# EAGLE design Joy2PS2_rev2_1 (EAGLE 7.6.0)
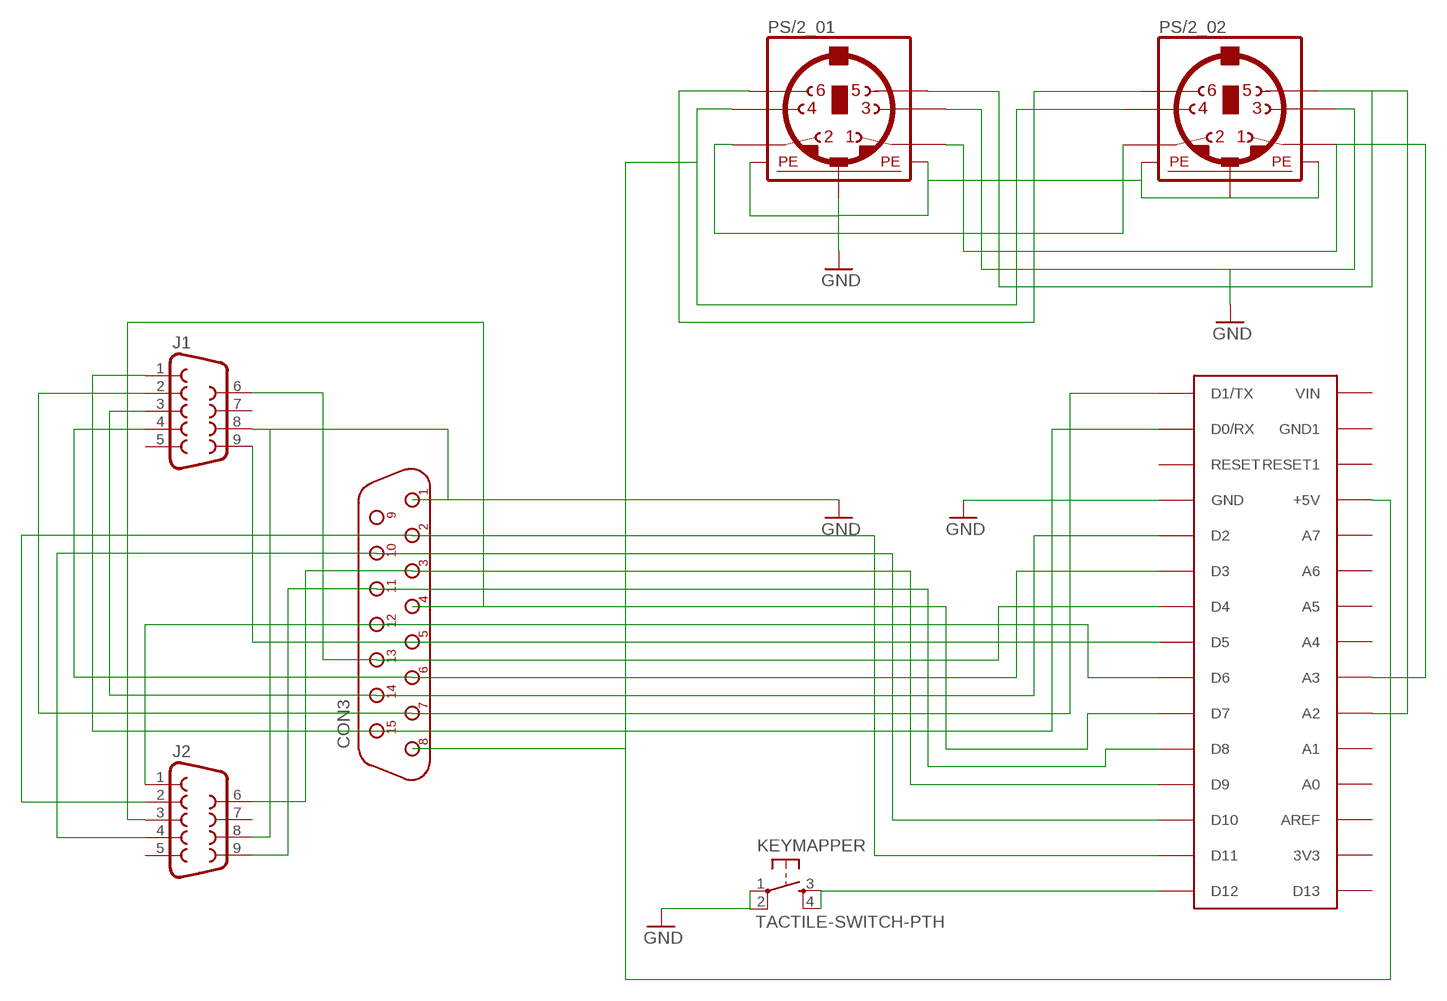
[diagram p0: schematic, sheet 1]

## Parts
ARDUINONANO  ARDUINONANO  [PDIP-32]
CON3  DB15M/90  [D-15M/90]
J1  DB9MALE  [DB9_MALE]
J2  DB9MALE  [DB9_MALE]
KEYMAPPER  TACTILE-SWITCH-PTH  [TAC-SWITCH-PTH]
PS/2_01  MINI_DIN_6  [M_DIN6]
PS/2_02  MINI_DIN_6  [M_DIN6]

## Nets
GND: ARDUINONANO.GND CON3.1 J1.8 J2.8 KEYMAPPER.1 KEYMAPPER.2 PS/2_01.3 PS/2_01.SH1(PE1) PS/2_01.SH2(PE2) PS/2_01.SH3(PE3) PS/2_02.3 PS/2_02.SH1(PE1) PS/2_02.SH2(PE2) PS/2_02.SH3(PE3)
N$1: ARDUINONANO.A3 PS/2_01.1 PS/2_02.1
N$2: PS/2_01.2 PS/2_02.2
N$3: ARDUINONANO.+5V CON3.8 PS/2_01.4 PS/2_02.4
N$5: ARDUINONANO.A2 PS/2_01.5 PS/2_02.5
N$6: ARDUINONANO.D10 CON3.10 J2.4
N$7: ARDUINONANO.D8 CON3.11 J2.9
N$8: ARDUINONANO.D0/RX CON3.15 J1.1
N$9: ARDUINONANO.D1/TX CON3.7 J1.2
N$10: ARDUINONANO.D2 CON3.14 J1.3
N$11: ARDUINONANO.D3 CON3.6 J1.4
N$12: ARDUINONANO.D4 CON3.13 J1.6
N$13: ARDUINONANO.D5 CON3.5 J1.9
N$14: ARDUINONANO.D6 CON3.12 J2.1
N$15: ARDUINONANO.D7 CON3.4 J2.3
N$16: ARDUINONANO.D9 CON3.3 J2.6
N$17: ARDUINONANO.D11 CON3.2 J2.2
N$19: ARDUINONANO.D12 KEYMAPPER.3 KEYMAPPER.4
N$20: PS/2_01.6 PS/2_02.6
Unconnected: ARDUINONANO.3V3 ARDUINONANO.A0 ARDUINONANO.A1 ARDUINONANO.A4 ARDUINONANO.A5 ARDUINONANO.A6 ARDUINONANO.A7 ARDUINONANO.AREF ARDUINONANO.D13 ARDUINONANO.GND1 ARDUINONANO.RESET ARDUINONANO.RESET1 ARDUINONANO.VIN CON3.9 J1.5 J1.7 J2.5 J2.7

## Library data of the parts
ARDUINONANO = jet-lib2:ARDUINONANO
CON3 = connect:DB15M/90
J1 J2 = SparkFun-Connectors:DB9: DB9 Connector Standard DB9 (D-Sub 9) serial connector. Can be used for CAN bus as well as RS485 and RS232. Footprint production proven. Spark Fun Electronics SKU : PRT-00429; PROD_ID: CONN-09904
KEYMAPPER = GeekAmmo:TACTILE-SWITCH: Tactile Switch 4 Pins, SPST NO
PS/2_01 PS/2_02 = mini_din:MINI_DIN_6

## Board
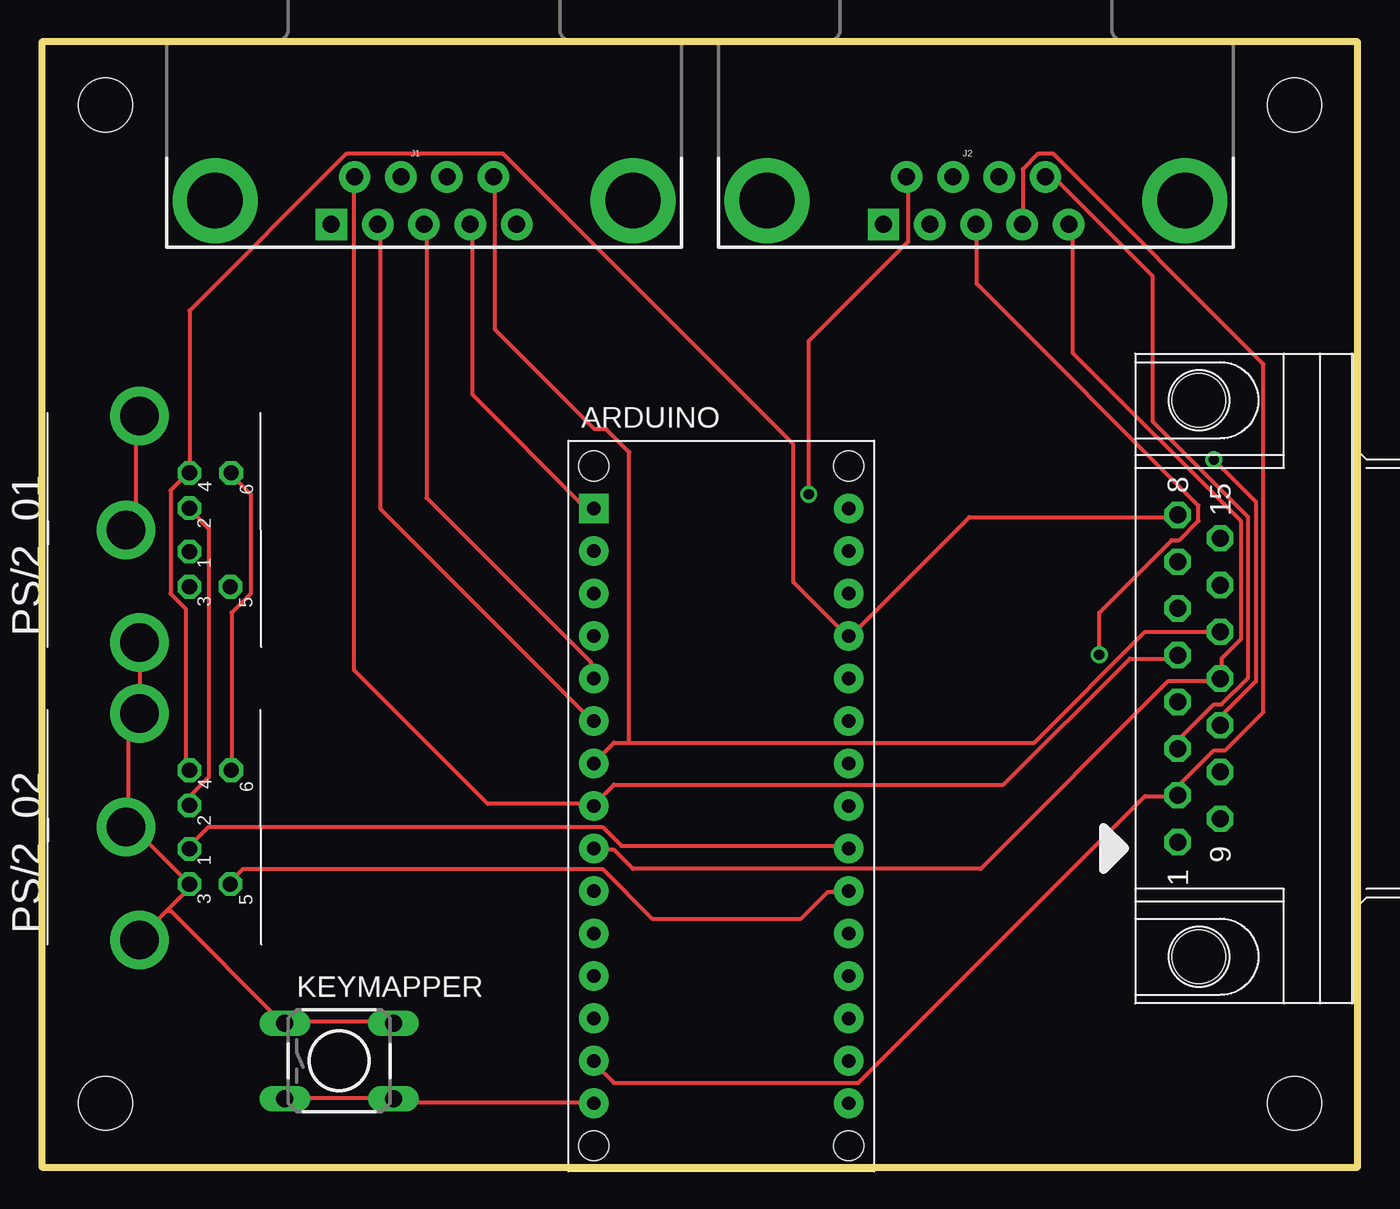
[diagram p1: board, top side]
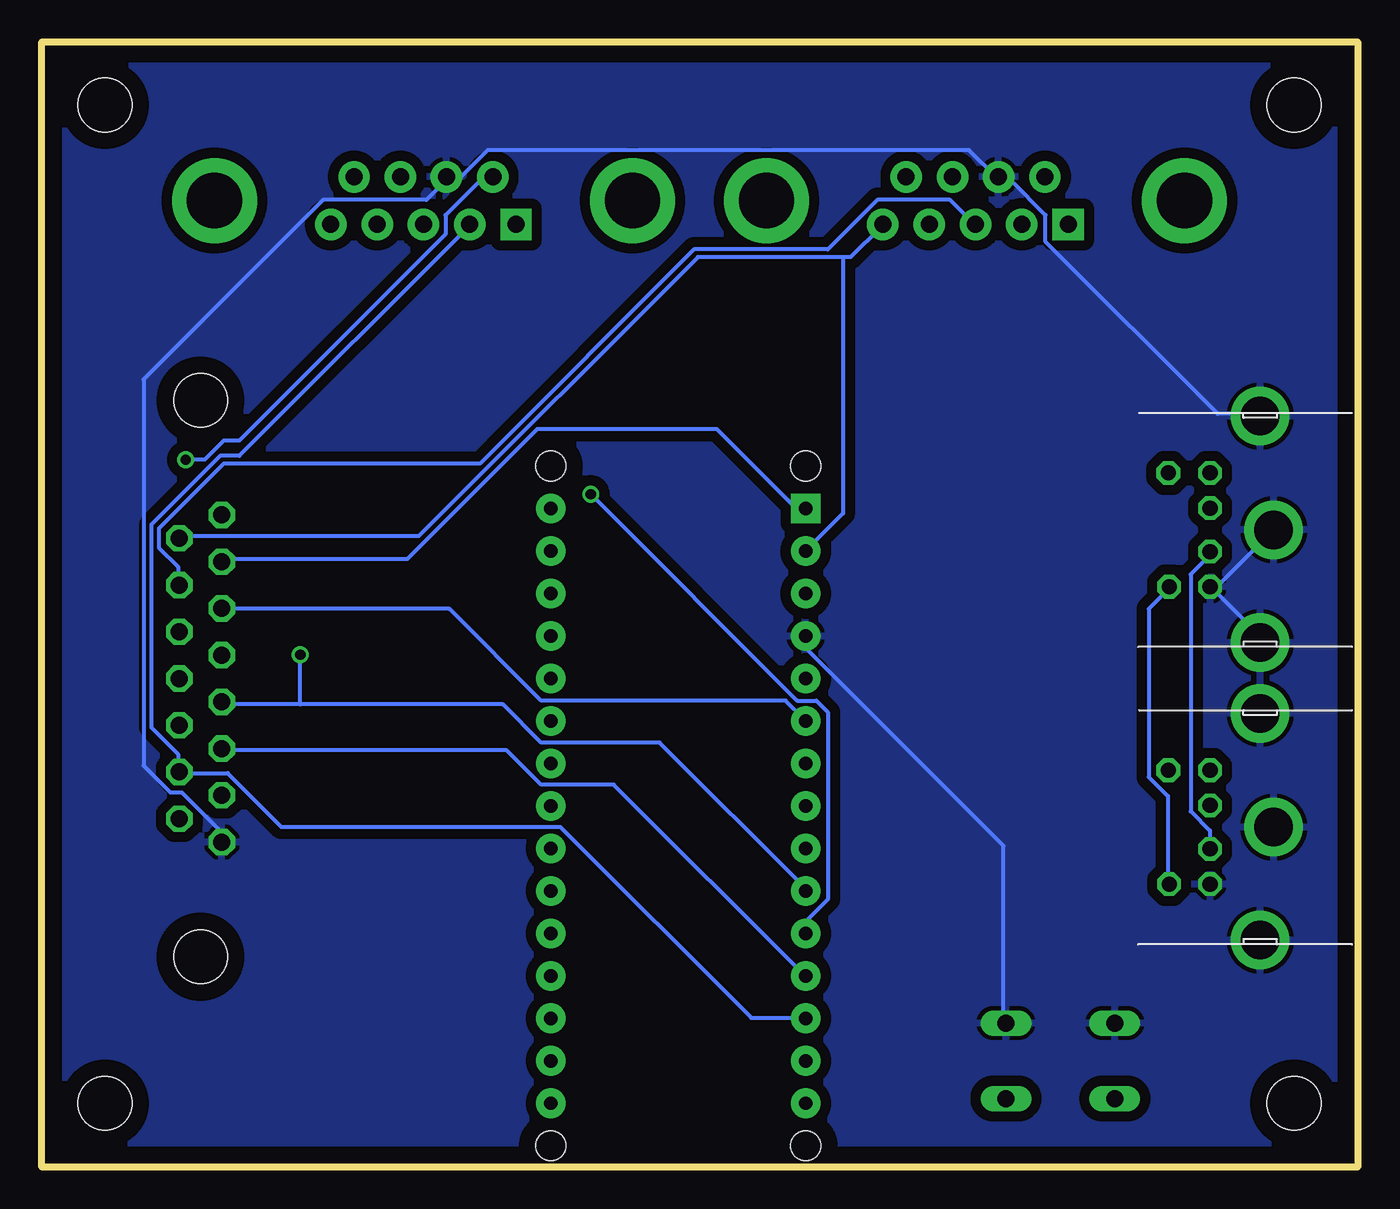
[diagram p2: board, bottom side, seen from below]

Size 78.71 x 67.28 mm. Coordinates in mm from the lower left corner, seen from the top.
Outline: 0,0 78.71,0 78.71,67.28 0,67.28 0,0
Copper layers (1*16): Top 0.035mm / dielectric 1.5mm / Bottom 0.035mm
Design rules "default": minimum track width 10mil, minimum drill 24mil, track to track 8mil, track to pad 8mil, pad to pad 8mil, via to via 8mil, smd to smd 8mil, copper to edge 40mil, drill to drill 8mil, minimum pad ring 10mil, minimum via ring 8mil, stop-mask expansion 4mil, vias tented up to drill 0mil, thermal gap 10mil
Holes 3.2 mm at 74.93,63.5 74.93,3.81 3.81,63.5 3.81,3.81

### Footprints (pad centres in the part's own frame; a part is rotated, then mirrored left to right if it is on the bottom)
PDIP-32 = drill 0.8 pad 1.778: 3V3 15.24,-35.56; +5V 15.24,-10.16; A0 15.24,-30.48; A1 15.24,-27.94; A2 15.24,-25.4; A3 15.24,-22.86; A4 15.24,-20.32; A5 15.24,-17.78; A6 15.24,-15.24; A7 15.24,-12.7; AREF 15.24,-33.02; D0/RX 0,-5.08; D2 0,-12.7; D3 0,-15.24; D4 0,-17.78; D5 0,-20.32; D6 0,-22.86; D7 0,-25.4; D8 0,-27.94; D9 0,-30.48; D10 0,-33.02; D11 0,-35.56; D12 0,-38.1; D13 15.24,-38.1; GND 0,-10.16; GND1 15.24,-5.08; RESET 0,-7.62; RESET1 15.24,-7.62; VIN 15.24,-2.54 | drill 0.8 pad 1.778 square: D1/TX 0,-2.54 | hole 1.778: 0,0; 0,-40.64; 15.24,-40.64; 15.24,0
D-15M/90 = drill 1.016 pad 1.575 octagon: 1 9.779,-1.27; 2 6.985,-1.27; 3 4.191,-1.27; 4 1.397,-1.27; 5 -1.397,-1.27; 6 -4.191,-1.27; 7 -6.985,-1.27; 8 -9.779,-1.27; 9 8.382,1.27; 10 5.588,1.27; 11 2.794,1.27; 12 0,1.27; 13 -2.794,1.27; 14 -5.588,1.27; 15 -8.382,1.27 | hole 3.2: 16.637,0; -16.637,0
DB9_MALE = drill 1.016 pad 1.88: 1 5.54,-1.42; 2 2.77,-1.42; 3 0,-1.42; 4 -2.77,-1.42; 6 4.15,1.42; 7 1.38,1.42; 8 -1.38,1.42; 9 -4.15,1.42 | drill 1.016 pad 1.88 square: 5 -5.54,-1.42 | drill 3.302 pad 5.08: G1 -12.5,0; G2 12.5,0
TAC-SWITCH-PTH = drill 1.016 pad 1.524 long: 1 -3.251,2.261; 2 3.251,2.261; 3 -3.251,-2.261; 4 3.251,-2.261
M_DIN6 = drill 0.9 pad 1.422 octagon: 1 -1.3,-3.75; 2 1.3,-3.75; 3 -3.4,-3.75; 4 3.4,-3.75; 5 -3.4,-6.2; 6 3.4,-6.25 | drill 2.3 pad 3.5: SH1 6.8,-0.75; SH2 0,0.05; SH3 -6.75,-0.75

### Placement (x,y rotation side)
ARDUINONANO  33.02,41.91 0 top
CON3  69.22,29.21 270 top
J1  22.86,57.78 0 top
J2  55.88,57.78 0 top
KEYMAPPER  17.78,6.35 0 top
PS/2_01  5.08,38.1 90 top
PS/2_02  5.08,20.32 90 top

### Tracks (layer width: path | path; a pad name or v marks a point on that pad's centre or on a via)
GND
  Top 0.254: KEYMAPPER.2 20.95,8.69 14.55,8.69 KEYMAPPER.1 14.33,8.69 7.7,15.32 7.47,15.32 | 7.47,15.32 5.87,13.72 PS/2_02.SH3 | 7.47,15.32 8.61,16.46 8.61,16.92 PS/2_02.3 8.61,17.14 5.64,20.12 5.18,20.12 PS/2_02.SH2 5.18,20.34 5.18,26.52 5.64,26.98 PS/2_02.SH1 5.87,27.2 5.87,31.32 PS/2_01.SH3 | PS/2_01.SH1 5.64,44.81 5.64,38.63 5.18,38.18 PS/2_01.SH2
  Bottom 0.254: CON3.1 68.05,19.43 68.05,20.12 70.33,22.4 71.02,22.4 72.62,24 72.62,47.09 61.87,57.84 55.7,57.84 54.56,58.98 J2.8 54.33,59.21 53.65,59.21 52.05,60.81 23.24,60.81 21.64,59.21 J1.8 21.41,58.98 20.73,58.98 18.67,56.92 18.67,55.32 8.38,45.03 5.87,45.03 PS/2_01.SH1 | ARDUINONANO.GND 32.84,31.55 32.84,30.86 21.18,19.2 21.18,8.69 KEYMAPPER.2 | 8.61,34.52 5.64,31.55 PS/2_01.SH3 | 8.61,34.52 5.18,37.95 PS/2_01.SH2 | 8.61,34.52 PS/2_01.3
  pour Bottom (isolate 0.61): 0,67.31 78.74,67.31 78.74,0 0,0
N$1
  Top 0.254: ARDUINONANO.A3 48.16,19.2 34.67,19.2 33.53,20.34 9.98,20.34 8.84,19.2 PS/2_02.1
  Bottom 0.254: PS/2_02.1 8.84,19.2 8.84,20.12 9.98,21.26 9.98,35.43 8.84,36.58 PS/2_01.1
N$2
  Top 0.254: PS/2_02.2 8.84,21.72 8.84,22.17 9.98,23.32 9.98,38.18 8.84,39.32 PS/2_01.2
N$3
  Top 0.254: PS/2_02.4 8.61,23.77 8.61,33.38 7.7,34.29 7.7,40.46 8.61,41.38 PS/2_01.4 8.84,41.6 8.84,51.21 18.21,60.58 27.58,60.58 44.96,43.2 44.96,34.98 48.16,31.77 ARDUINONANO.+5V 48.39,31.77 55.47,38.86 67.82,38.86 CON3.8
N$5
  Top 0.254: ARDUINONANO.A2 48.16,16.46 47.02,16.46 45.41,14.86 36.5,14.86 33.53,17.83 12.04,17.83 11.35,17.14 PS/2_02.5
  Bottom 0.254: PS/2_02.5 11.35,17.14 11.35,22.17 12.5,23.32 12.5,33.38 11.35,34.52 PS/2_01.5
N$6
  Bottom 0.254: J2.4 53.19,56.24 66.9,42.52 68.05,42.52 72.16,38.41 72.16,26.29 70.56,24.69 70.56,23.77 CON3.10 70.33,23.55 67.59,23.55 64.39,20.34 47.7,20.34 36.27,8.91 33.07,8.91 ARDUINONANO.D10
N$7  (via drill 0.61)
  Top 0.254: v70.1,42.29 72.62,39.78 72.62,29.03 70.56,26.98 70.56,26.52 CON3.11 | v45.87,40.23 45.87,49.38 51.82,55.32 51.82,58.98 J2.9
  Bottom 0.254: v70.1,42.29 68.96,42.29 67.82,43.43 66.9,43.43 54.56,55.78 54.56,56.92 52.5,58.98 51.82,58.98 J2.9 | v45.87,40.23 33.53,27.89 32.38,27.89 31.7,27.2 31.7,16 32.84,14.86 32.84,14.17 ARDUINONANO.D8
N$8
  Bottom 0.254: 30.79,54.41 30.33,54.41 28.5,56.24 J1.1 | 30.79,54.41 39.47,54.41 56.16,37.72 70.33,37.72 CON3.15 | 30.79,54.41 30.79,39.09 32.84,37.03 ARDUINONANO.D0/RX
N$9
  Top 0.254: J1.2 25.76,56.24 25.76,46.18 32.38,39.55 32.84,39.55 ARDUINONANO.D1/TX
  Bottom 0.254: CON3.7 67.82,36.35 56.84,36.35 49.07,44.12 38.33,44.12 33.76,39.55 33.07,39.55 ARDUINONANO.D1/TX
N$10
  Top 0.254: ARDUINONANO.D2 32.84,29.26 32.84,30.18 23.01,40.01 23.01,56.24 J1.3
  Bottom 0.254: CON3.14 70.56,34.98 70.56,35.89 71.7,37.03 71.7,38.18 67.82,42.06 52.5,42.06 39.7,54.86 31.7,54.86 28.73,57.84 24.38,57.84 23.01,56.46 J1.3
N$11
  Top 0.254: J1.4 20.27,56.24 20.27,39.32 32.84,26.75 ARDUINONANO.D3
  Bottom 0.254: CON3.6 67.82,33.38 54.33,33.38 48.84,27.89 34.21,27.89 33.07,26.75 ARDUINONANO.D3
N$12
  Top 0.254: CON3.13 65.99,32 59.36,25.38 35.13,25.38 | 35.13,25.38 34.21,25.38 33.07,24.23 ARDUINONANO.D4 | 35.13,25.38 35.13,42.75 33.76,44.12 33.07,44.12 27.13,50.06 27.13,58.98 J1.6
N$13
  Top 0.254: CON3.5 67.82,30.4 65.08,30.4 57.53,22.86 34.21,22.86 33.07,21.72 ARDUINONANO.D5 32.84,21.72 26.67,21.72 18.67,29.72 18.67,58.98 J1.9
N$14
  Top 0.254: J2.1 61.65,56.24 61.65,48.69 71.7,38.63 71.7,31.55 70.56,30.4 70.56,29.26 CON3.12 70.33,29.03 67.36,29.03 56.16,17.83 35.36,17.83 34.21,18.97 33.07,18.97 ARDUINONANO.D6
N$15  (via drill 0.61)
  Top 0.254: v63.25,30.63 63.25,33.15 67.59,37.49 68.05,37.49 69.19,38.63 69.19,39.55 55.93,52.81 55.93,56.24 J2.3
  Bottom 0.254: 63.25,27.66 51.13,27.66 48.84,25.38 41.76,25.38 33.07,16.69 ARDUINONANO.D7 | 63.25,27.66 67.82,27.66 CON3.4 | 63.25,27.66 v63.25,30.63
N$16
  Top 0.254: J2.6 60.05,58.98 60.73,58.98 66.45,53.26 66.45,44.58 72.16,38.86 72.16,29.26 70.56,27.66 70.1,27.66 68.05,25.6 68.05,25.15 CON3.3
  Bottom 0.254: CON3.3 67.82,24.92 50.9,24.92 48.84,22.86 44.5,22.86 33.07,11.43 ARDUINONANO.D9
N$17
  Top 0.254: ARDUINONANO.D11 33.07,6.17 34.21,5.03 48.84,5.03 65.99,22.17 67.82,22.17 CON3.2 68.05,22.4 68.05,22.86 70.1,24.92 70.79,24.92 73.08,27.2 73.08,48.01 60.5,60.58 59.59,60.58 58.67,59.66 58.67,56.46 J2.2
N$19
  Top 0.254: KEYMAPPER.3 14.55,4.12 20.95,4.12 KEYMAPPER.4 21.18,3.89 32.84,3.89 ARDUINONANO.D12
N$20
  Top 0.254: PS/2_02.6 11.35,23.77 11.35,33.15 12.5,34.29 12.5,40.23 11.35,41.38 PS/2_01.6